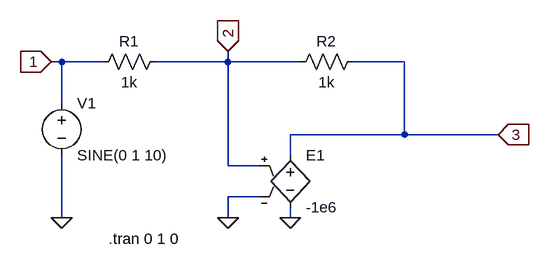
[diagram p0: schematic OpAmp vcvs model.asc]
OpAmp vcvs model.asc, the LTspice schematic file:
Version 4
SHEET 1 880 680
WIRE -64 144 -80 144
WIRE 0 144 -64 144
WIRE 192 144 192 128
WIRE 192 144 80 144
WIRE 304 144 192 144
WIRE 464 144 384 144
WIRE -64 208 -64 144
WIRE 464 256 464 144
WIRE 464 256 288 256
WIRE 608 256 464 256
WIRE 288 288 288 256
WIRE 192 304 192 144
WIRE 240 304 192 304
WIRE 240 352 192 352
WIRE -64 384 -64 288
WIRE 192 384 192 352
WIRE 288 384 288 368
FLAG -64 384 0
FLAG 288 384 0
FLAG 192 384 0
FLAG 192 128 2
IOPIN 192 128 In
FLAG 608 256 3
IOPIN 608 256 In
FLAG -80 144 1
IOPIN -80 144 In
SYMBOL e 288 272 R0
SYMATTR InstName E1
SYMATTR Value -1e6
SYMBOL res 96 128 R90
WINDOW 0 0 56 VBottom 2
WINDOW 3 32 56 VTop 2
SYMATTR InstName R1
SYMATTR Value 1k
SYMBOL res 400 128 R90
WINDOW 0 0 56 VBottom 2
WINDOW 3 32 56 VTop 2
SYMATTR InstName R2
SYMATTR Value 1k
SYMBOL voltage -64 192 R0
WINDOW 123 0 0 Left 0
WINDOW 39 0 0 Left 0
SYMATTR InstName V1
SYMATTR Value SINE(0 1 10)
TEXT 8 416 Left 2 !.tran 0 1 0

The netlist it stands for:
* OpAmp vcvs model.asc
E1 3 0 2 0 -1e6
R1 2 1 1k
R2 3 2 1k
V1 1 0 SINE(0 1 10)
.tran 0 1 0
.backanno
.end